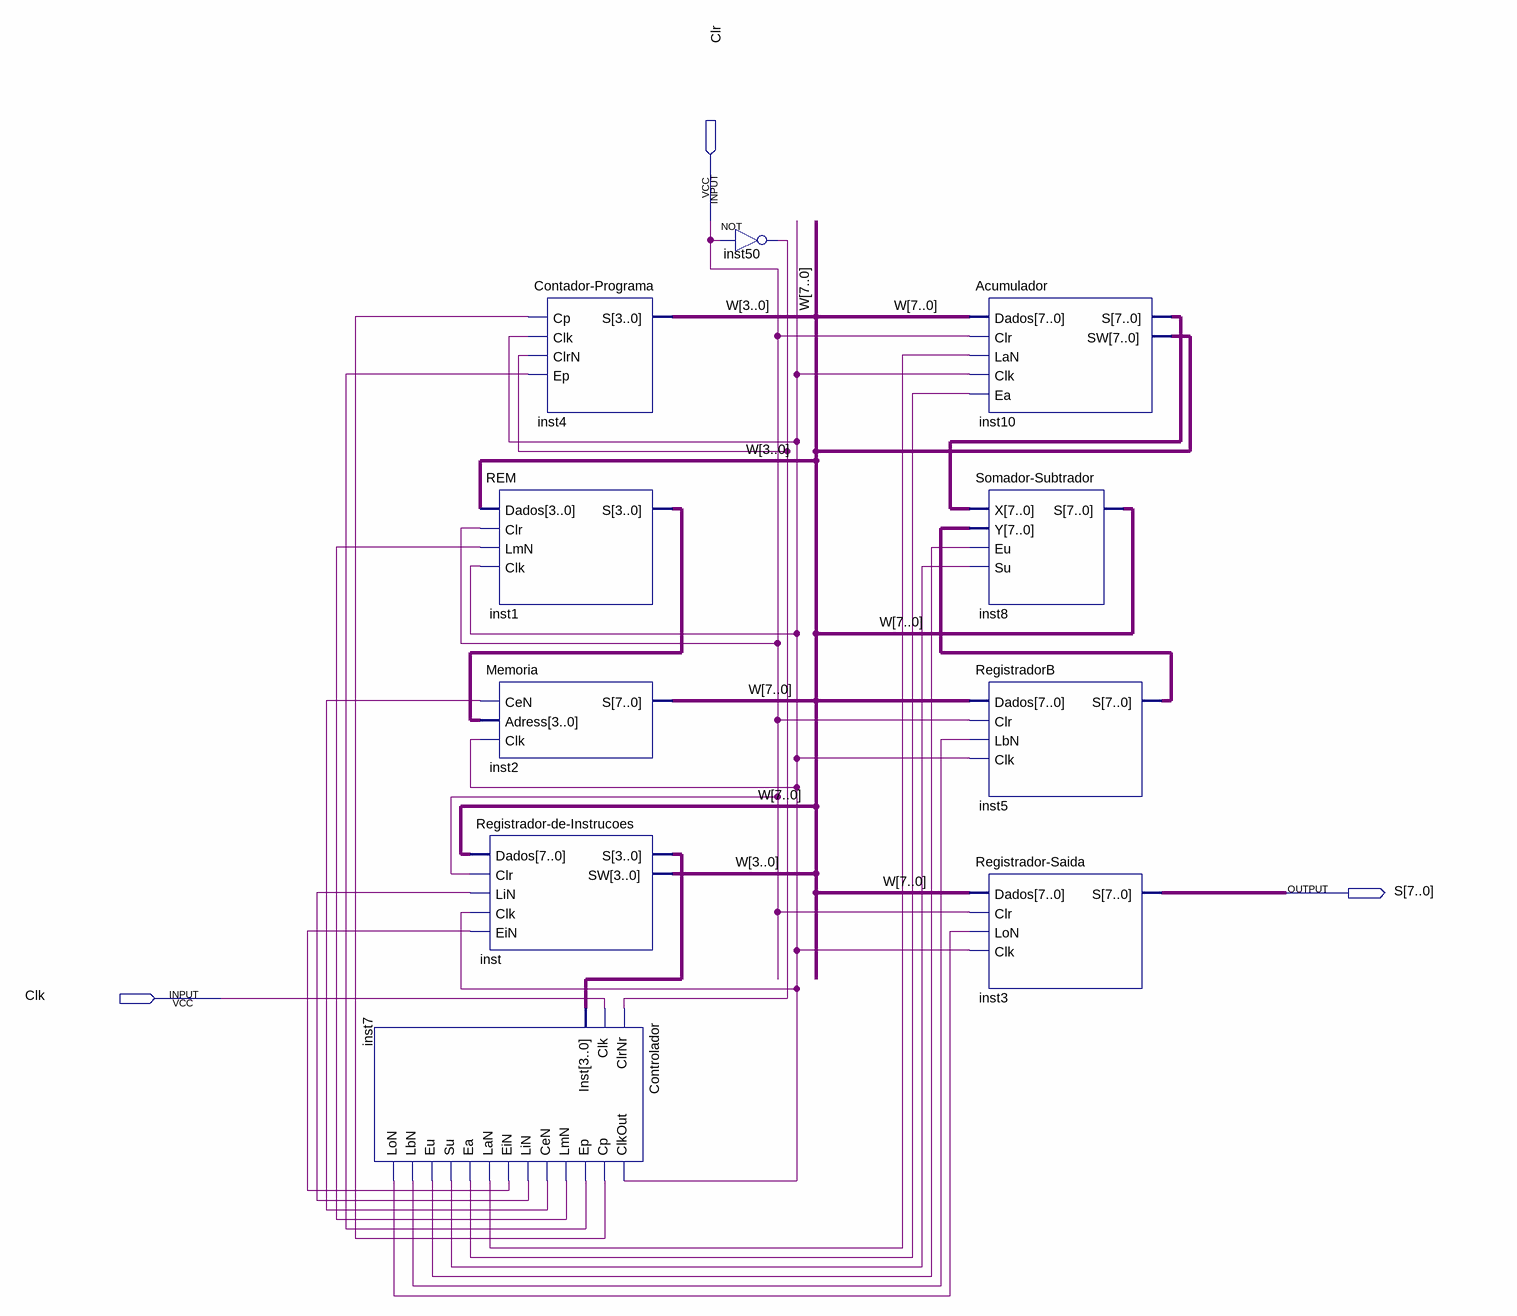
[diagram p0: schematic sheet]
// Quartus schematic MicroProcessador.bdf as structural Verilog: 10 symbols, 3 pins
module MicroProcessador (
  input  Clr,
  input  Clk,
  output [7:0] S
);

  wire inst7_cen, inst7_clkout, inst7_cp, inst7_ea, inst7_ein, inst7_ep, inst7_eu, inst7_lan, inst7_lbn,
       inst7_lin, inst7_lmn, inst7_lon, inst7_su, inst50_out;
  wire [3:0] inst1_s, inst_s;
  wire [7:0] inst5_s, inst10_s, W;

  Controlador inst7 (
    .ClrNr(inst50_out), .Clk(Clk), .Inst(inst_s), .ClkOut(inst7_clkout), .Cp(inst7_cp), .Ep(inst7_ep),
    .LmN(inst7_lmn), .CeN(inst7_cen), .LiN(inst7_lin), .EiN(inst7_ein), .LaN(inst7_lan), .Ea(inst7_ea),
    .Su(inst7_su), .Eu(inst7_eu), .LbN(inst7_lbn), .LoN(inst7_lon));
  \Contador-Programa  inst4 (.Cp(inst7_cp), .Clk(inst7_clkout), .ClrN(inst50_out), .Ep(inst7_ep), .S(W[3:0]));
  REM inst1 (.Dados(W[3:0]), .Clr(Clr), .LmN(inst7_lmn), .Clk(inst7_clkout), .S(inst1_s));
  Memoria inst2 (.CeN(inst7_cen), .Adress(inst1_s), .Clk(inst7_clkout), .S(W));
  \Registrador-de-Instrucoes  inst (
    .Dados(W), .Clr(Clr), .LiN(inst7_lin), .Clk(inst7_clkout), .EiN(inst7_ein), .S(inst_s), .SW(W[3:0]));
  not inst50 (inst50_out, Clr);
  Acumulador inst10 (.Dados(W), .Clr(Clr), .LaN(inst7_lan), .Clk(inst7_clkout), .Ea(inst7_ea), .S(inst10_s), .SW(W));
  \Somador-Subtrador  inst8 (.X(inst10_s), .Y(inst5_s), .Eu(inst7_eu), .Su(inst7_su), .S(W));
  RegistradorB inst5 (.Dados(W), .Clr(Clr), .LbN(inst7_lbn), .Clk(inst7_clkout), .S(inst5_s));
  \Registrador-Saida  inst3 (.Dados(W), .Clr(Clr), .LoN(inst7_lon), .Clk(inst7_clkout), .S(S));
endmodule
